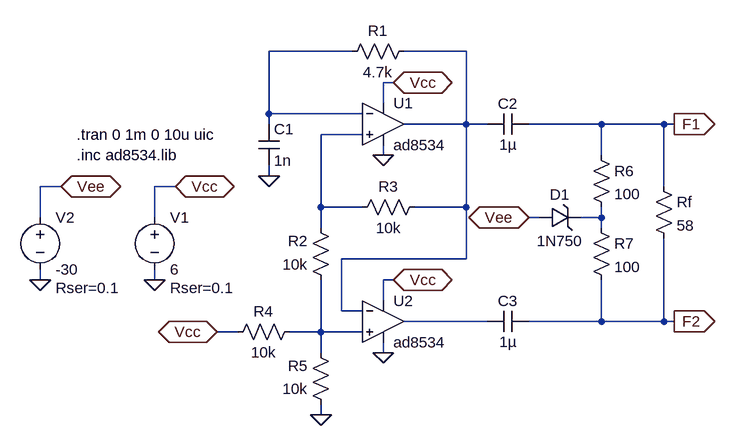
[diagram p0: schematic ad8534-filament.asc]
ad8534-filament.asc, the LTspice schematic file:
Version 4
SHEET 1 1548 852
WIRE 192 96 64 96
WIRE 368 96 272 96
WIRE 256 144 240 144
WIRE 240 176 240 144
WIRE 64 192 64 96
WIRE 208 192 64 192
WIRE 64 208 64 192
WIRE 368 208 368 96
WIRE 368 208 272 208
WIRE 400 208 368 208
WIRE 576 208 464 208
WIRE 672 208 576 208
WIRE 688 208 672 208
WIRE 208 224 144 224
WIRE 240 256 240 240
WIRE 576 256 576 208
WIRE 64 288 64 272
WIRE -256 304 -288 304
WIRE -80 304 -112 304
WIRE 672 304 672 208
WIRE 144 336 144 224
WIRE 208 336 144 336
WIRE 368 336 368 208
WIRE 368 336 288 336
WIRE -288 352 -288 304
WIRE -112 352 -112 304
WIRE 480 352 464 352
WIRE 576 352 576 336
WIRE 576 352 544 352
WIRE 144 368 144 336
WIRE 576 368 576 352
WIRE 368 416 368 336
WIRE 368 416 176 416
WIRE -288 448 -288 432
WIRE -112 448 -112 432
WIRE 256 448 240 448
WIRE 240 480 240 448
WIRE 176 496 176 416
WIRE 208 496 176 496
WIRE 400 512 272 512
WIRE 576 512 576 448
WIRE 576 512 464 512
WIRE 672 512 672 384
WIRE 672 512 576 512
WIRE 688 512 672 512
WIRE 16 528 -16 528
WIRE 144 528 144 448
WIRE 144 528 96 528
WIRE 208 528 144 528
WIRE 144 560 144 528
WIRE 240 560 240 544
WIRE 144 656 144 640
FLAG -112 448 0
FLAG -80 304 Vcc
IOPIN -80 304 BiDir
FLAG 240 256 0
FLAG 256 144 Vcc
IOPIN 256 144 BiDir
FLAG 64 288 0
FLAG 240 560 0
FLAG 256 448 Vcc
IOPIN 256 448 BiDir
FLAG -16 528 Vcc
IOPIN -16 528 BiDir
FLAG 144 656 0
FLAG -288 448 0
FLAG -256 304 Vee
IOPIN -256 304 BiDir
FLAG 464 352 Vee
IOPIN 464 352 BiDir
FLAG 688 208 F1
IOPIN 688 208 Out
FLAG 688 512 F2
IOPIN 688 512 Out
SYMBOL Opamps\\opamp2 240 144 R0
SYMATTR InstName U1
SYMATTR Value ad8534
SYMBOL voltage -112 336 R0
WINDOW 123 0 0 Left 0
WINDOW 39 24 124 Left 2
SYMATTR SpiceLine Rser=0.1
SYMATTR InstName V1
SYMATTR Value 6
SYMBOL cap 48 208 R0
SYMATTR InstName C1
SYMATTR Value 1n
SYMBOL res 288 80 R90
WINDOW 0 0 56 VBottom 2
WINDOW 3 32 56 VTop 2
SYMATTR InstName R1
SYMATTR Value 4.7k
SYMBOL Opamps\\opamp2 240 448 R0
SYMATTR InstName U2
SYMATTR Value ad8534
SYMBOL res 160 464 R180
WINDOW 0 36 76 Left 2
WINDOW 3 36 40 Left 2
SYMATTR InstName R2
SYMATTR Value 10k
SYMBOL res 304 320 R90
WINDOW 0 0 56 VBottom 2
WINDOW 3 32 56 VTop 2
SYMATTR InstName R3
SYMATTR Value 10k
SYMBOL res 112 512 R90
WINDOW 0 0 56 VBottom 2
WINDOW 3 32 56 VTop 2
SYMATTR InstName R4
SYMATTR Value 10k
SYMBOL res 160 656 R180
WINDOW 0 36 76 Left 2
WINDOW 3 36 40 Left 2
SYMATTR InstName R5
SYMATTR Value 10k
SYMBOL res 656 288 R0
SYMATTR InstName Rf
SYMATTR Value 58
SYMBOL cap 464 192 R90
WINDOW 0 0 32 VBottom 2
WINDOW 3 32 32 VTop 2
SYMATTR InstName C2
SYMATTR Value 1µ
SYMBOL cap 464 496 R90
WINDOW 0 0 32 VBottom 2
WINDOW 3 32 32 VTop 2
SYMATTR InstName C3
SYMATTR Value 1µ
SYMBOL voltage -288 336 R0
WINDOW 123 0 0 Left 0
WINDOW 39 24 124 Left 2
SYMATTR SpiceLine Rser=0.1
SYMATTR InstName V2
SYMATTR Value -30
SYMBOL zener 480 368 R270
WINDOW 0 36 32 VTop 2
WINDOW 3 -4 32 VBottom 2
SYMATTR InstName D1
SYMATTR Value 1N750
SYMBOL res 560 240 R0
SYMATTR InstName R6
SYMATTR Value 100
SYMBOL res 560 352 R0
SYMATTR InstName R7
SYMATTR Value 100
TEXT -232 256 Left 2 !.inc ad8534.lib
TEXT -232 224 Left 2 !.tran 0 1m 0 10u uic

The netlist it stands for:
* ad8534-filament.asc
XU1 N003 N001 Vcc 0 N002 ad8534  ; pins In+ In- V+ V- OUT
V1 Vcc 0 6 Rser=0.1
C1 N001 0 1n
R1 N002 N001 4.7k
XU2 N006 N002 Vcc 0 N005 ad8534  ; pins In+ In- V+ V- OUT
R2 N006 N003 10k
R3 N002 N003 10k
R4 N006 Vcc 10k
R5 0 N006 10k
Rf F1 F2 58
C2 F1 N002 1µ
C3 F2 N005 1µ
V2 Vee 0 -30 Rser=0.1
D1 Vee N004 1N750
R6 F1 N004 100
R7 N004 F2 100
.model D D
.lib standard.dio
.inc ad8534.lib
.tran 0 1m 0 10u uic
.backanno
.end